# EAGLE design ARK (EAGLE 9.5.2)
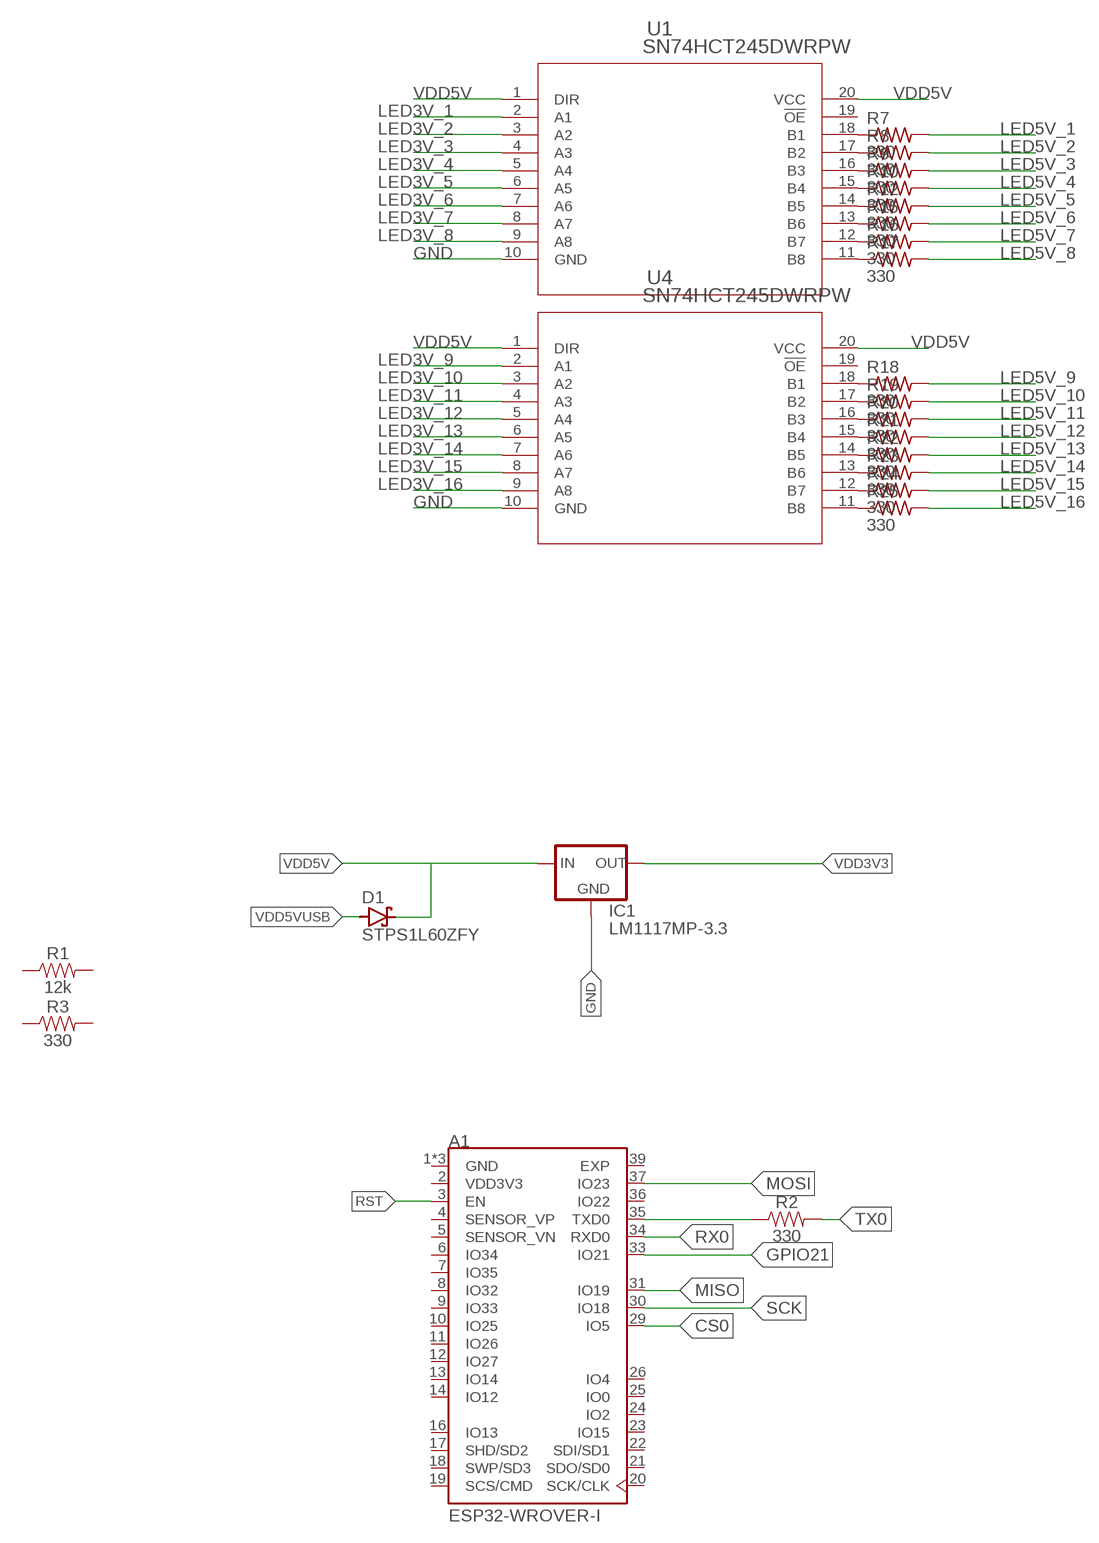
[diagram p0: schematic, sheet 1, part 1 of 2]
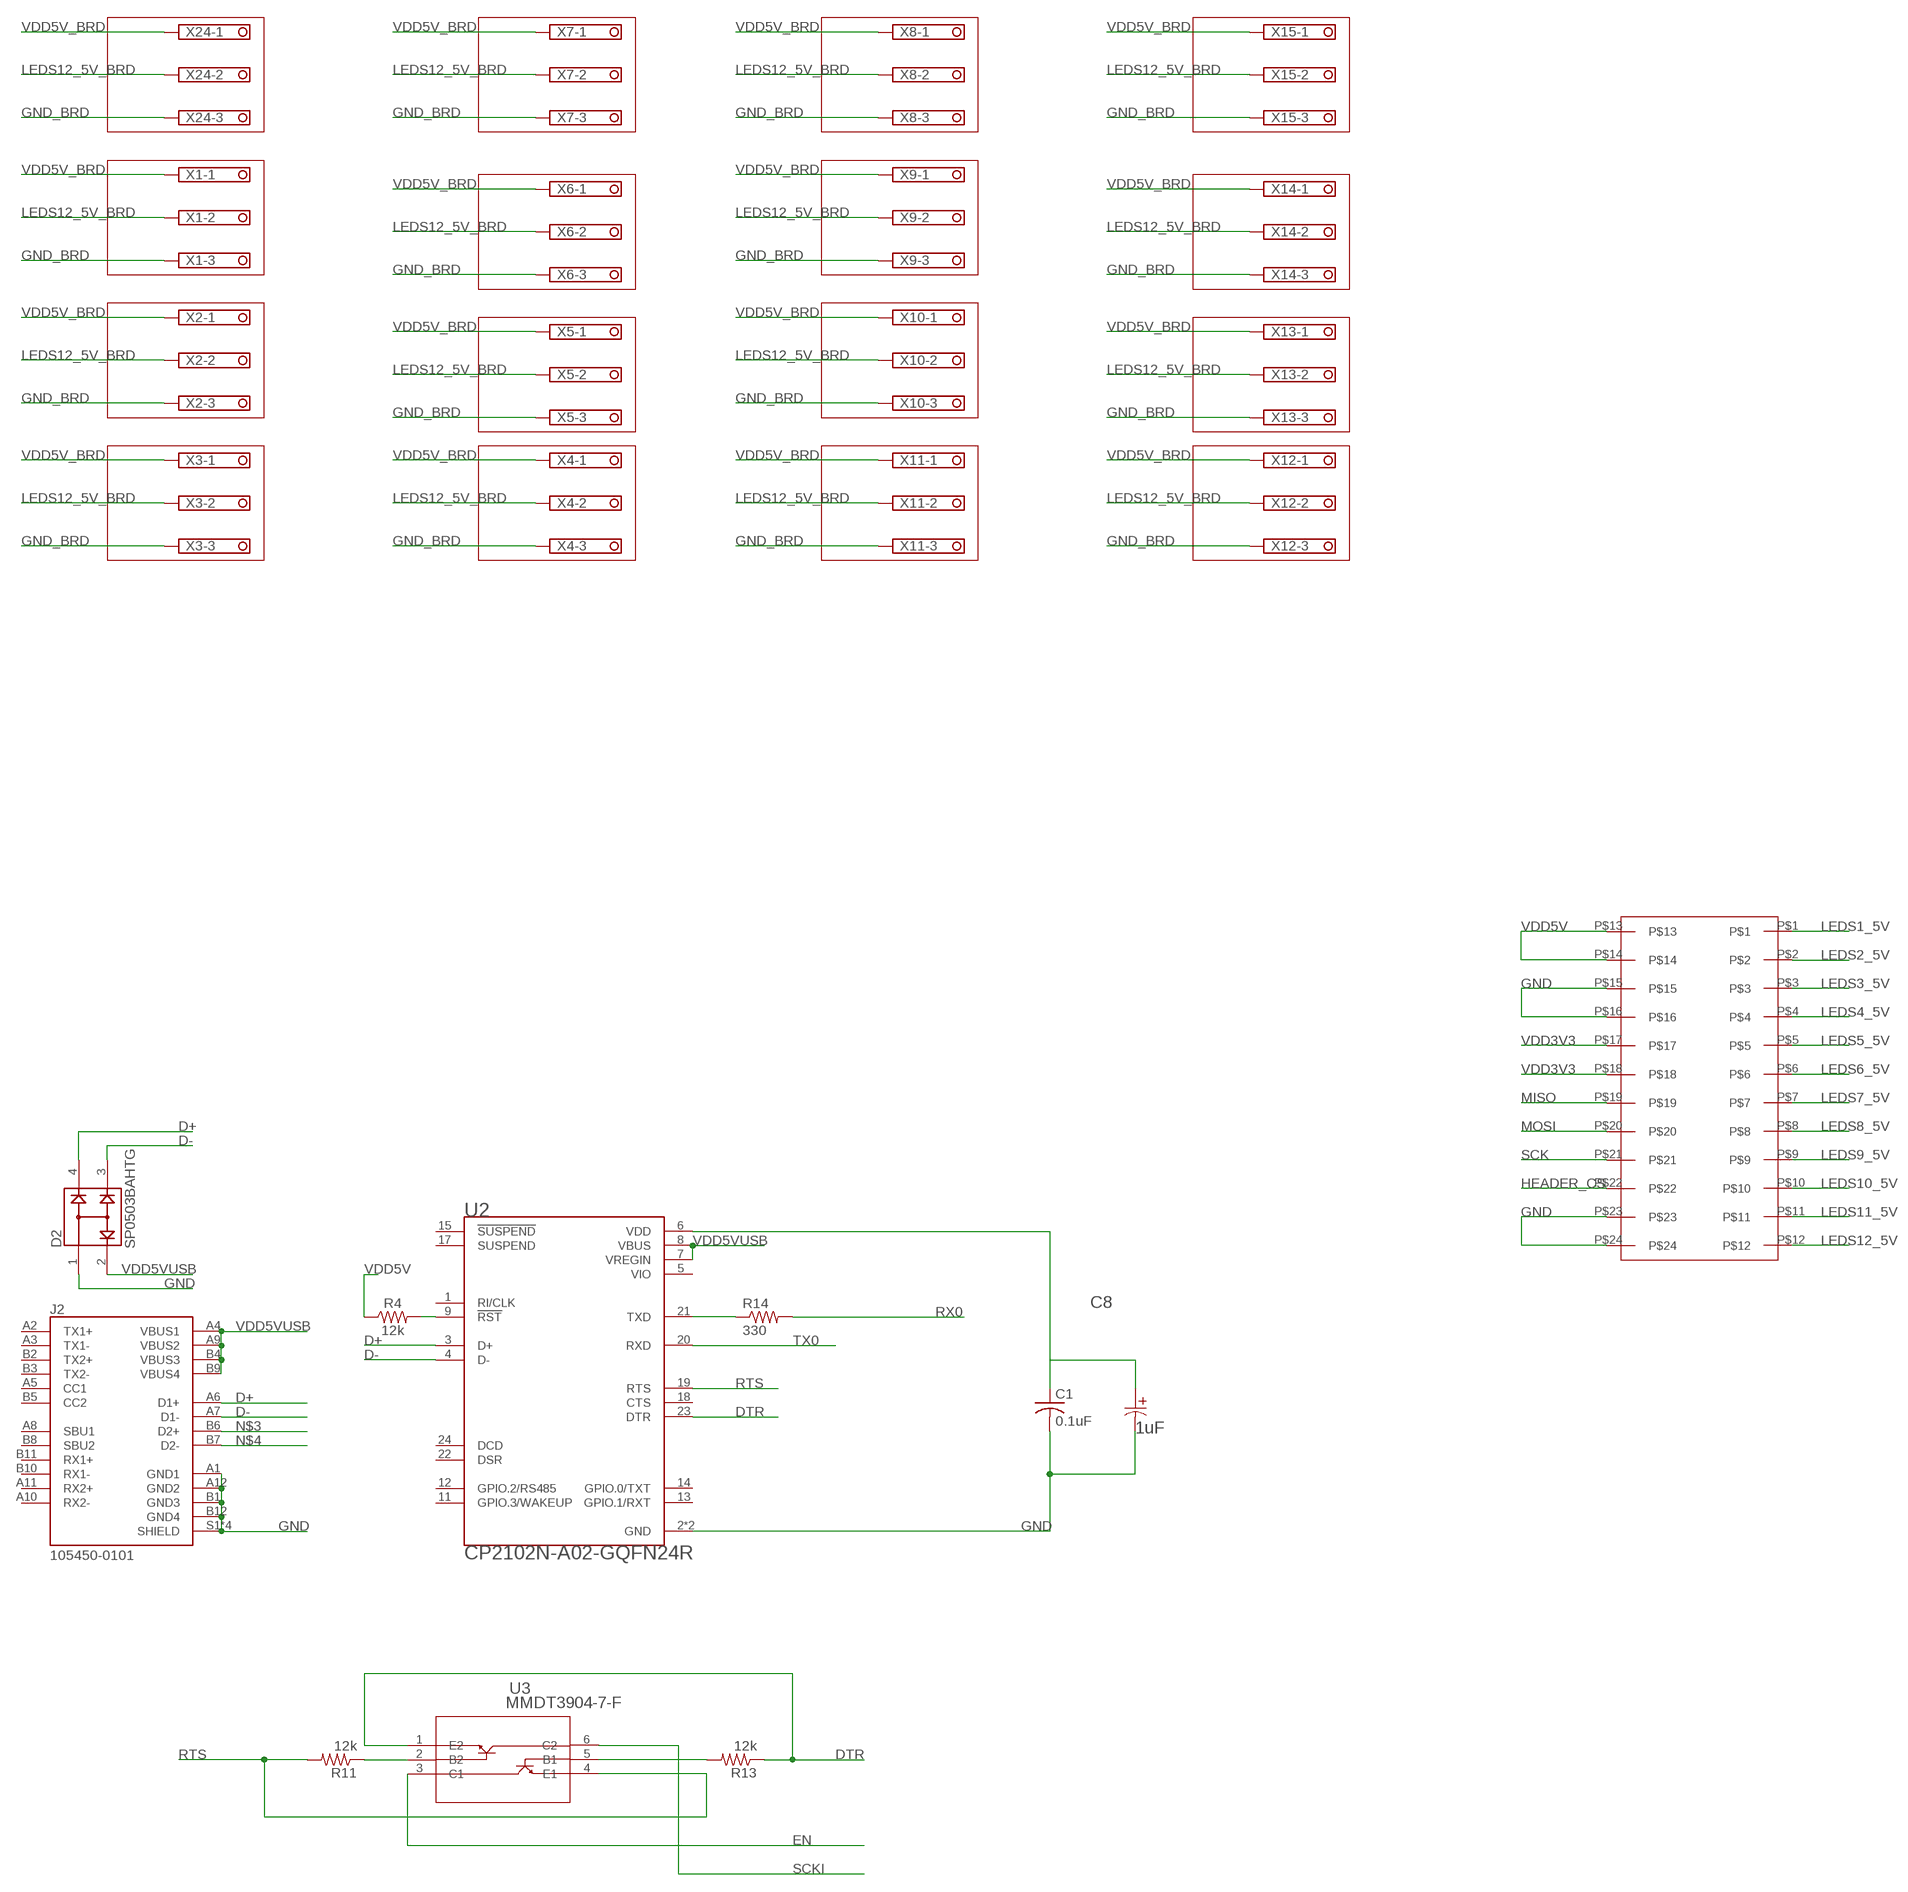
[diagram p1: schematic, sheet 1, part 2 of 2]

## Parts
A1  ESP32-WROVER-I  [XCVR_ESP32-WROVER-I]
C1  0.1uF  C-USC0402  [C0402]
C8  1uF  EEEFC1V1R0R  [CAP_EEFC_B]
D1  STPS1L60ZFY  MBR0520LT1G  [SOD-123]
D2  SP0503BAHTG  [SOT143]
IC1  LM1117MP-3.3  [SOT223]
J2  105450-0101  [MOLEX_105450-0101]
R1  12k  12KOHM-0603-1/10W-1%  [0603]
R2  330  12KOHM-0603-1/10W-1%  [0603]
R3  330  12KOHM-0603-1/10W-1%  [0603]
R4  12k  12KOHM-0603-1/10W-1%  [0603]
R7  330  RC0603JR-070RL  [RES_0603]
R8  330  RC0603JR-070RL  [RES_0603]
R9  330  RC0603JR-070RL  [RES_0603]
R10  330  RC0603JR-070RL  [RES_0603]
R11  12k  RC0603JR-070RL  [RES_0603]
R12  330  RC0603JR-070RL  [RES_0603]
R13  12k  RC0603JR-070RL  [RES_0603]
R14  330  RC0603JR-070RL  [RES_0603]
R15  330  RC0603JR-070RL  [RES_0603]
R16  330  RC0603JR-070RL  [RES_0603]
R17  330  RC0603JR-070RL  [RES_0603]
R18  330  RC0603JR-070RL  [RES_0603]
R19  330  RC0603JR-070RL  [RES_0603]
R20  330  RC0603JR-070RL  [RES_0603]
R21  330  RC0603JR-070RL  [RES_0603]
R22  330  RC0603JR-070RL  [RES_0603]
R23  330  RC0603JR-070RL  [RES_0603]
R24  330  RC0603JR-070RL  [RES_0603]
R25  330  RC0603JR-070RL  [RES_0603]
U1  SN74HCT245DWRPW  [PW]
U2  CP2102N-A02-GQFN24R  [SILABS_CP2102N-A02-GQFN24R]
U3  MMDT3904-7-F  [SOT-363]
U4  SN74HCT245DWRPW  [PW]
U$9  MY_HEADER  [MY_HEADER]
X1  TERMINAL-BLOCK-3.5MM-3-PIN-LONG-PAD  [TERMINAL-BLOCK-3-PIN-3.5MM-LONG-PAD]
X2  TERMINAL-BLOCK-3.5MM-3-PIN-LONG-PAD  [TERMINAL-BLOCK-3-PIN-3.5MM-LONG-PAD]
X3  TERMINAL-BLOCK-3.5MM-3-PIN-LONG-PAD  [TERMINAL-BLOCK-3-PIN-3.5MM-LONG-PAD]
X4  TERMINAL-BLOCK-3.5MM-3-PIN-LONG-PAD  [TERMINAL-BLOCK-3-PIN-3.5MM-LONG-PAD]
X5  TERMINAL-BLOCK-3.5MM-3-PIN-LONG-PAD  [TERMINAL-BLOCK-3-PIN-3.5MM-LONG-PAD]
X6  TERMINAL-BLOCK-3.5MM-3-PIN-LONG-PAD  [TERMINAL-BLOCK-3-PIN-3.5MM-LONG-PAD]
X7  TERMINAL-BLOCK-3.5MM-3-PIN-LONG-PAD  [TERMINAL-BLOCK-3-PIN-3.5MM-LONG-PAD]
X8  TERMINAL-BLOCK-3.5MM-3-PIN-LONG-PAD  [TERMINAL-BLOCK-3-PIN-3.5MM-LONG-PAD]
X9  TERMINAL-BLOCK-3.5MM-3-PIN-LONG-PAD  [TERMINAL-BLOCK-3-PIN-3.5MM-LONG-PAD]
X10  TERMINAL-BLOCK-3.5MM-3-PIN-LONG-PAD  [TERMINAL-BLOCK-3-PIN-3.5MM-LONG-PAD]
X11  TERMINAL-BLOCK-3.5MM-3-PIN-LONG-PAD  [TERMINAL-BLOCK-3-PIN-3.5MM-LONG-PAD]
X12  TERMINAL-BLOCK-3.5MM-3-PIN-LONG-PAD  [TERMINAL-BLOCK-3-PIN-3.5MM-LONG-PAD]
X13  TERMINAL-BLOCK-3.5MM-3-PIN-LONG-PAD  [TERMINAL-BLOCK-3-PIN-3.5MM-LONG-PAD]
X14  TERMINAL-BLOCK-3.5MM-3-PIN-LONG-PAD  [TERMINAL-BLOCK-3-PIN-3.5MM-LONG-PAD]
X15  TERMINAL-BLOCK-3.5MM-3-PIN-LONG-PAD  [TERMINAL-BLOCK-3-PIN-3.5MM-LONG-PAD]
X24  TERMINAL-BLOCK-3.5MM-3-PIN-LONG-PAD  [TERMINAL-BLOCK-3-PIN-3.5MM-LONG-PAD]

## Nets
CS0: A1.29(IO5)
D+ [LED Data]: D2.4 J2.A6(D1+) U2.3(D+)
D- [LED Data]: D2.3 J2.A7(D1-) U2.4(D-)
DTR [LED Data]: R13.1 U2.23(DTR) U3.1(E2)
EN [LED Data]: U3.3(C1)
GND: C1.2 C8.2 D2.1 IC1.1(GND) J2.A1(GND1) J2.A12(GND2) J2.B1(GND3) J2.B12(GND4) J2.S1(SHIELD) J2.S2(SHIELD) J2.S3(SHIELD) J2.S4(SHIELD) U1.10(GND) U2.2(GND) U2.25(GND) U4.10(GND) U$9.P$15 U$9.P$16 U$9.P$23 U$9.P$24
GND_BRD: X1.3 X2.3 X3.3 X4.3 X5.3 X6.3 X7.3 X8.3 X9.3 X10.3 X11.3 X12.3 X13.3 X14.3 X15.3 X24.3
GPIO21: A1.33(IO21)
HEADER_CS [LED Data]: U$9.P$22
LED3V_1: U1.2(A1)
LED3V_2: U1.3(A2)
LED3V_3: U1.4(A3)
LED3V_4: U1.5(A4)
LED3V_5: U1.6(A5)
LED3V_6: U1.7(A6)
LED3V_7: U1.8(A7)
LED3V_8: U1.9(A8)
LED3V_9: U4.2(A1)
LED3V_10: U4.3(A2)
LED3V_11: U4.4(A3)
LED3V_12: U4.5(A4)
LED3V_13: U4.6(A5)
LED3V_14: U4.7(A6)
LED3V_15: U4.8(A7)
LED3V_16: U4.9(A8)
LED5V_1: R7.2
LED5V_2: R8.2
LED5V_3: R9.2
LED5V_4: R10.2
LED5V_5: R12.2
LED5V_6: R15.2
LED5V_7: R16.2
LED5V_8: R17.2
LED5V_9: R18.2
LED5V_10: R19.2
LED5V_11: R20.2
LED5V_12: R21.2
LED5V_13: R22.2
LED5V_14: R23.2
LED5V_15: R24.2
LED5V_16: R25.2
LEDS1_5V [LED Data]: U$9.P$1
LEDS2_5V [LED Data]: U$9.P$2
LEDS3_5V [LED Data]: U$9.P$3
LEDS4_5V [LED Data]: U$9.P$4
LEDS5_5V [LED Data]: U$9.P$5
LEDS6_5V [LED Data]: U$9.P$6
LEDS7_5V [LED Data]: U$9.P$7
LEDS8_5V [LED Data]: U$9.P$8
LEDS9_5V [LED Data]: U$9.P$9
LEDS10_5V [LED Data]: U$9.P$10
LEDS11_5V [LED Data]: U$9.P$11
LEDS12_5V [LED Data]: U$9.P$12
LEDS12_5V_BRD: X1.2 X2.2 X3.2 X4.2 X5.2 X6.2 X7.2 X8.2 X9.2 X10.2 X11.2 X12.2 X13.2 X14.2 X15.2 X24.2
MISO: A1.31(IO19) U$9.P$19
MOSI: A1.37(IO23) U$9.P$20
N$1: A1.35(TXD0) R2.1
N$2 [LED Data]: C1.1 C8.1 U2.6(VDD)
N$3 [LED Data]: J2.B6(D2+)
N$4 [LED Data]: J2.B7(D2-)
N$5: D1.C
N$6: R4.2 U2.9(!RST)
N$7 [LED Data]: R11.1 U3.2(B2)
N$8 [LED Data]: R13.2 U3.5(B1)
N$11: R7.1 U1.18(B1)
N$12: R8.1 U1.17(B2)
N$13: R9.1 U1.16(B3)
N$14: R10.1 U1.15(B4)
N$15: R12.1 U1.14(B5)
N$16: R15.1 U1.13(B6)
N$17: R16.1 U1.12(B7)
N$18 [LED Data]: R14.1 U2.21(TXD)
N$19: R17.1 U1.11(B8)
N$20: R18.1 U4.18(B1)
N$21: R19.1 U4.17(B2)
N$22: R20.1 U4.16(B3)
N$23: R21.1 U4.15(B4)
N$24: R22.1 U4.14(B5)
N$25: R23.1 U4.13(B6)
N$26: R24.1 U4.12(B7)
N$27: R25.1 U4.11(B8)
RST: A1.3(EN)
RTS [LED Data]: R11.2 U2.19(RTS) U3.4(E1)
RX0: A1.34(RXD0) R14.2
SCK: A1.30(IO18) U$9.P$21
SCKI [LED Data]: U3.6(C2)
TX0: R2.2 U2.20(RXD)
VDD3V3: IC1.2(OUT) IC1.4(OUT) U$9.P$17 U$9.P$18
VDD5V: IC1.3(IN) R4.1 U1.1(DIR) U1.20(VCC) U4.1(DIR) U4.20(VCC) U$9.P$13 U$9.P$14
VDD5V_BRD: X1.1 X2.1 X3.1 X4.1 X5.1 X6.1 X7.1 X8.1 X9.1 X10.1 X11.1 X12.1 X13.1 X14.1 X15.1 X24.1
VDD5VUSB: D1.A D2.2 J2.A4(VBUS1) J2.A9(VBUS2) J2.B4(VBUS3) J2.B9(VBUS4) U2.7(VREGIN) U2.8(VBUS)
Unconnected: A1.4(SENSOR_VP) A1.5(SENSOR_VN) A1.6(IO34) A1.7(IO35) A1.8(IO32) A1.9(IO33) A1.10(IO25) A1.11(IO26) A1.12(IO27) A1.13(IO14) A1.14(IO12) A1.16(IO13) A1.17(SHD/SD2) A1.18(SWP/SD3) A1.19(SCS/CMD) A1.20(SCK/CLK) A1.21(SDO/SD0) A1.22(SDI/SD1) A1.23(IO15) A1.24(IO2) A1.25(IO0) A1.26(IO4) A1.36(IO22) J2.A2(TX1+) J2.A3(TX1-) J2.A5(CC1) J2.A8(SBU1) J2.A10(RX2-) J2.A11(RX2+) J2.B2(TX2+) J2.B3(TX2-) J2.B5(CC2) J2.B8(SBU2) J2.B10(RX1-) J2.B11(RX1+) R1.1 R1.2 R3.1 R3.2 U1.19(!OE) U2.1(RI/CLK) U2.5(VIO) U2.11(GPIO.3/WAKEUP) U2.12(GPIO.2/RS485) U2.13(GPIO.1/RXT) U2.14(GPIO.0/TXT) U2.15(!SUSPEND) U2.17(SUSPEND) U2.18(CTS) U2.22(DSR) U2.24(DCD) U4.19(!OE)

## Power pins joined to a net without a drawn wire
EXP: A1.39(EXP)
GND: A1.1(GND) A1.15(GND) A1.38(GND)
VDD3V3: A1.2(VDD3V3)

## Library data of the parts
A1 = ESP32-WROVER-I:ESP32-WROVER-I: Module: combo; GPIO, I2C x2, I2S x2, SDIO, SPI x3, UART x3; U.FL; AVAILABILITY: Unavailable; DESCRIPTION: Module: combo; GPIO, I2C x2, I2S x2, SDIO, SPI x3, UART x3; U.FL; MF: Espressif Systems; MP: ESP32-WROVER-I; PACKAGE: Module Espressif Systems; PRICE: None
C1 = resistor:C-US: CAPACITOR, American symbol
C8 = EEE-FC1V1R0R:EEEFC1V1R0R; MANUFACTURER_PART_NUMBER: EEEFC1V1R0R; VENDOR: Panasonic
D1 = Diodes:MBR0520LT1G: DIODE SCHOTTKY 20V 500MA SOD123 Manufacturer's datasheet <https://www.onsemi.com/pub/Collateral/MBR0520LT1-D.PDF>; CREATED_BY: PCBLayout.com; DIGIKEY_PART_NUMBER: MBR0520LT1GOSTR-ND; MANUFACTURER: ON Semiconductor; MPN: MBR0520LT1G; PACKAGE: SOD-123
D2 = SP0503BAHTG:SP0503BAHTG: TVS DIODE 5.5VWM 8.5VC SOT143; DESCRIPTION: SP050xBA Series 8 V 30 pF Uni-Directional SMT TVS Avalanche Diode Array SOT-143; DIGI-KEY_PART_NUMBER: F2715CT-ND; DIGI-KEY_PURCHASE_URL: https://www.digikey.com/product-detail/en/littelfuse-inc/SP0503BAHTG/F2715CT-ND/1154322?utm_source=snapeda&utm_medium=aggregator&utm_campaign=symbol; MF: Littelfuse Inc.; MP: SP0503BAHTG; PACKAGE: SOT-143 Littelfuse
IC1 = lm1117:LM1117?-*: 800mA Low-Dropout Linear Regulator Source: http://ww1.microchip.com/downloads/en/DeviceDoc/39760d.pdf; MF: Texas Instruments; MPN: LM1117MP-3.3; OC_FARNELL: 9778195; OC_NEWARK: 28X3416
J2 = 105450-0101:105450-0101: USB Shielded I/O Receptacle; Type C; Right Angle; Surface Mount; Gold over Nickel; DESCRIPTION: USB Shielded I/O Receptacle; Type C; Right Angle; Surface Mount; Gold over Nickel; DIGI-KEY_PART_NUMBER: WM12856CT-ND; DIGI-KEY_PURCHASE_URL: https://www.digikey.com/product-detail/en/molex/1054500101/WM12856CT-ND/5843891?utm_source=snapeda&utm_medium=aggregator&utm_campaign=symbol; MF: Molex; MP: 1054500101; PACKAGE: None
R1 R4 = SparkFun-Resistors:12KOHM: 12kΩ resistor A resistor is a passive two-terminal electrical component that implements electrical resistance as a circuit element. Resistors act to reduce current flow, and, at the same time, act to lower voltage levels within circuits. - Wikipedia; PROD_ID: RES-10327
R2 R3 = SparkFun-Resistors:12KOHM: 12kΩ resistor A resistor is a passive two-terminal electrical component that implements electrical resistance as a circuit element. Resistors act to reduce current flow, and, at the same time, act to lower voltage levels within circuits. - Wikipedia; PROD_ID: RES-10327; VALUE: 12k
R7-R25 = Resistor_Capacitor:RC0603JR-070RL: RES SMD 0 OHM JUMPER 1/10W 0603 Manufacturer's datasheet <http://www.yageo.com/documents/recent/PYu-RC_Group_51_RoHS_L_10.pdf>; CREATED_BY: PCBLayout.com; DIGIKEY_PART_NUMBER: 311-0.0GRTR-ND; MANUFACTURER: Yageo; MPN: RC0603JR-070RL; PACKAGE: SMD 0603
U1 U4 = SN74HCT245DWR :SN74HCT245DWR
U2 = CP2102N-A02-GQFN20R:CP2102N-A02-GQFN24R: IC USB TO UART BRIDGE QFN20
U3 = MMDT3904:MMDT3904-7-F; MANUFACTURER_PART_NUMBER: MMDT39047F; VENDOR: Diodes Inc
U$9 = MY_HEADER:MY_HEADER
X1-X15 X24 = Rembrandt Electronics - Terminal Block 3-5mm v1-0:TERMINAL-BLOCK-3.5MM-3-PIN: Terminal Block 3.5mm Pitch: 3,5 mm Number of pins: 3 Created by Rembrandt Electronics www.rembrandtelectronics.com

## Net classes
1 LED Data: width 0.305 mm, drill 0.25 mm

## Board
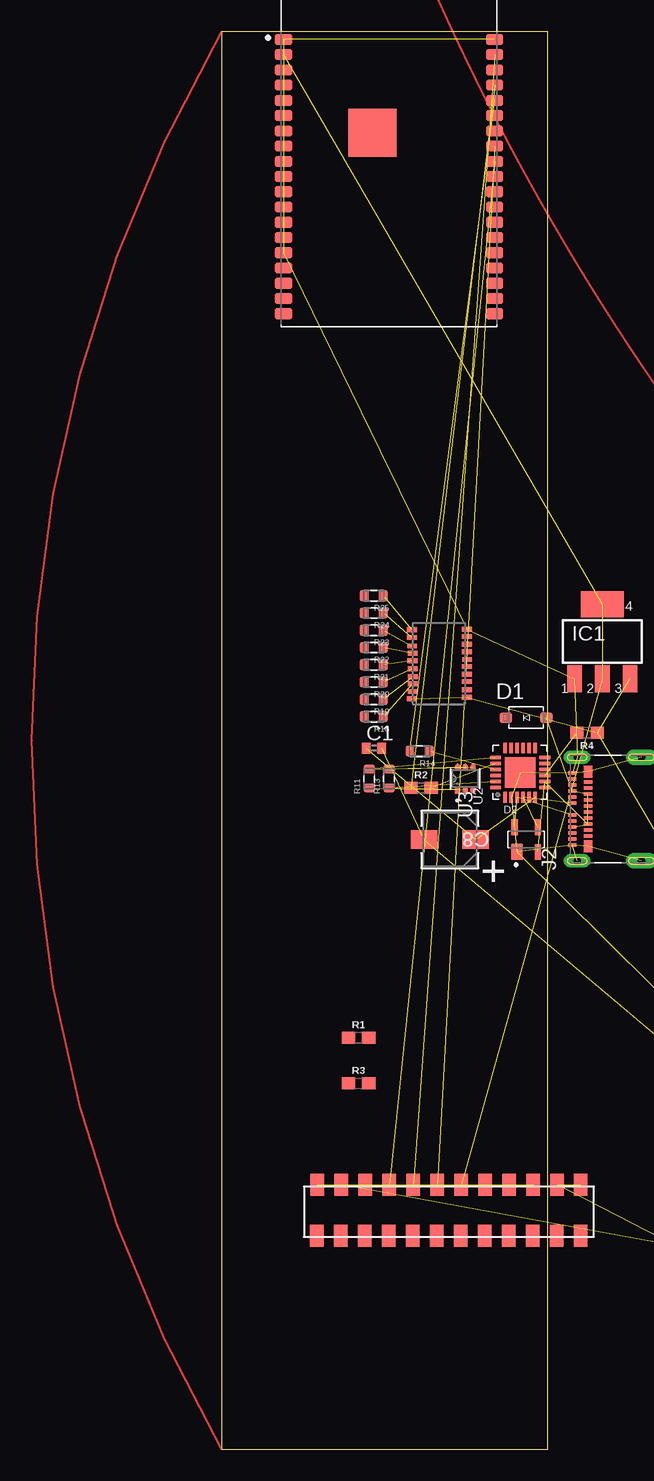
[diagram p2: board, top side]

Size 27.23 x 118.1 mm. Coordinates in mm from the lower left corner, seen from the top.
Outline: 0,0 27.23,0 27.23,118.1 0,118.1 0,0
Copper layers (1*16): Top 0.035mm / dielectric 1.5mm / Bottom 0.035mm
Design rules "default": minimum track width 6mil, minimum drill 0.35mm, track to track 6mil, track to pad 6mil, pad to pad 6mil, via to via 6mil, smd to smd 6mil, copper to edge 40mil, drill to drill 6mil, minimum pad ring 10mil, minimum via ring 8mil, stop-mask expansion 4mil, vias tented up to drill 0mil, thermal gap 10mil

### Footprints (pad centres in the part's own frame; a part is rotated, then mirrored left to right if it is on the bottom)
XCVR_ESP32-WROVER-I = smd 1.45 x 0.93: 1 -8.81,8.26; 2 -8.81,6.99; 3 -8.81,5.72; 4 -8.81,4.45; 5 -8.81,3.18; 6 -8.81,1.91; 7 -8.81,0.64; 8 -8.81,-0.63; 9 -8.81,-1.9; 10 -8.81,-3.17; 11 -8.81,-4.44; 12 -8.81,-5.71; 13 -8.81,-6.98; 14 -8.81,-8.25; 15 -8.81,-9.52; 16 -8.81,-10.79; 17 -8.81,-12.06; 18 -8.81,-13.33; 19 -8.81,-14.6; 20 8.81,-14.6; 21 8.81,-13.33; 22 8.81,-12.06; 23 8.81,-10.79; 24 8.81,-9.52; 25 8.81,-8.25; 26 8.81,-6.98; 27 8.81,-5.71; 28 8.81,-4.44; 29 8.81,-3.17; 30 8.81,-1.9; 31 8.81,-0.63; 32 8.81,0.64; 33 8.81,1.91; 34 8.81,3.18; 35 8.81,4.45; 36 8.81,5.72; 37 8.81,6.99; 38 8.81,8.26 | smd 4 x 4: 39 -1.38,0.47
C0402 = smd 0.7 x 0.9: 1 -0.65,0; 2 0.65,0
CAP_EEFC_B = smd 2.21 x 1.575: 1 -2.159,0; 2 2.159,0
SOD-123 = smd 1.02 x 0.86: A 1.68,0; C -1.68,0
SOT143 = smd 0.99 x 1.3: 1 -0.76,-1.025 | smd 0.59 x 1.3: 2 0.96,-1.025; 3 0.96,1.025; 4 -0.96,1.025
SOT223 = smd 1.219 x 2.235: 1 -2.311,-3.099; 2 0,-3.099; 3 2.311,-3.099 | smd 3.6 x 2.2: 4 0,3.099
MOLEX_105450-0101 = smd 0.3 x 0.7: A1 -3,3.77; A2 -2.5,3.77; A3 -2,3.77; A4 -1.5,3.77; A5 -1,3.77; A6 -0.5,3.77; A7 0.5,3.77; A8 1,3.77; A9 1.5,3.77; A10 2,3.77; A11 2.5,3.77; A12 3,3.77; B2 2.25,2.47; B3 1.75,2.47; B4 1.25,2.47; B5 0.75,2.47; B6 0.25,2.47; B7 -0.25,2.47; B8 -0.75,2.47; B9 -1.25,2.47; B10 -1.75,2.47; B11 -2.25,2.47 | smd 1 x 0.7: B1 3.1,2.47; B12 -3.1,2.47 | drill 0.6 pad 1.1 long: S1 -4.32,3.36; S2 4.32,3.36 | drill 0.6 pad 1.3 long: S3 -4.32,-2; S4 4.32,-2
0603 = smd 1.1 x 1: 1 -0.85,0; 2 0.85,0
RES_0603 = smd 0.74 x 0.93: 1 -0.795,0; 2 0.795,0
PW = smd 0.813 x 0.406: 1 -0.148,-0.418; 2 -0.152,-1.056; 3 -0.152,-1.736; 4 -0.152,-2.34; 5 -0.152,-2.995; 6 -0.156,-3.575; 7 -0.152,-4.233; 8 -0.152,-4.859; 9 -0.152,-5.488; 10 -0.148,-6.098; 11 4.446,-6.065; 12 4.441,-5.404; 13 4.412,-4.699; 14 4.382,-4.082; 15 4.408,-3.466; 16 4.382,-2.796; 17 4.357,-2.151; 18 4.382,-1.548; 19 4.382,-0.908; 20 4.467,-0.317
SILABS_CP2102N-A02-GQFN24R = smd 0.9 x 0.3: 1 -1.55,1.75; 2 -1.55,1.25; 3 -1.55,0.75; 4 -1.55,0.25; 5 -1.55,-0.25; 6 -1.55,-0.75; 13 2.55,-0.75; 14 2.55,-0.25; 15 2.55,0.25; 16 2.55,0.75; 17 2.55,1.25; 18 2.55,1.75 | smd 0.3 x 0.9: 7 -0.75,-1.55; 8 -0.25,-1.55; 9 0.25,-1.55; 10 0.75,-1.55; 11 1.25,-1.55; 12 1.75,-1.55; 19 1.75,2.55; 20 1.25,2.55; 21 0.75,2.55; 22 0.25,2.55; 23 -0.25,2.55; 24 -0.75,2.55 | smd 2.55 x 2.55: 25 0.5,0.5
SOT-363 = smd 0.6 x 0.42: 1 -0.95,0.65; 2 -0.95,0; 3 -0.95,-0.65; 4 0.95,-0.65; 5 0.95,0; 6 0.95,0.65
MY_HEADER = smd 1.12 x 1.83: P$1 -2,0; P$2 0.005,0; P$3 2.005,0; P$4 4.005,0; P$5 6.005,0; P$6 8.005,0; P$7 10.005,0; P$8 12.005,0; P$9 14.005,0; P$10 16.005,0; P$11 18.005,0; P$12 20.005,0; P$13 -2,-4.25; P$14 -0.045,-4.25; P$15 1.955,-4.25; P$16 3.955,-4.25; P$17 5.955,-4.25; P$18 7.955,-4.25; P$19 9.955,-4.25; P$20 11.955,-4.25; P$21 13.955,-4.25; P$22 15.955,-4.25; P$23 17.955,-4.25; P$24 19.955,-4.25
TERMINAL-BLOCK-3-PIN-3.5MM-LONG-PAD = drill 1.1 pad 1.7 long: 1 -3.5,-0.1; 2 0,-0.1; 3 3.5,-0.1

### Placement (x,y rotation side)
A1  13.97,109.22 0 top
C1  12.7,58.42 0 top
C8  19.05,50.8 180 top
D1  25.4,60.96 0 top
D2  25.4,50.8 0 top
IC1  31.75,67.31 0 top
J2  33.02,53.34 90 top
R1  11.43,34.29 0 top
R2  16.64,55.12 0 top
R3  11.43,30.48 0 top
R4  30.48,59.69 180 top
R7  54.61,5.08 180 top  (outside the outline)
R8  54.61,6.52 180 top  (outside the outline)
R9  54.61,7.96 180 top  (outside the outline)
R10  54.61,9.4 180 top  (outside the outline)
R11  12.32,55.88 90 top
R12  54.61,10.84 180 top  (outside the outline)
R13  13.97,55.88 90 top
R14  16.51,58.17 180 top
R15  54.61,12.28 180 top  (outside the outline)
R16  54.61,13.72 180 top  (outside the outline)
R17  54.61,15.16 180 top  (outside the outline)
R18  12.7,61.04 180 top
R19  12.7,62.48 180 top
R20  12.7,63.92 180 top
R21  12.7,65.36 180 top
R22  12.7,66.8 180 top
R23  12.7,68.24 180 top
R24  12.7,69.68 180 top
R25  12.7,71.12 180 top
U1  62.23,6.35 180 top  (outside the outline)
U2  25.4,55.88 90 top
U3  20.32,55.88 90 top
U4  20.32,62.23 180 top
U$9  27.94,17.78 180 top
X1  8.89,-16.51 0 top  (outside the outline)
X2  8.89,-26.67 0 top  (outside the outline)
X3  8.89,-36.83 0 top  (outside the outline)
X4  8.89,-46.99 0 top  (outside the outline)
X5  8.89,-57.15 0 top  (outside the outline)
X6  8.89,-67.31 0 top  (outside the outline)
X7  8.89,-77.47 0 top  (outside the outline)
X8  8.89,-87.63 0 top  (outside the outline)
X9  8.89,-97.79 0 top  (outside the outline)
X10  8.89,-107.95 0 top  (outside the outline)
X11  8.89,-118.11 0 top  (outside the outline)
X12  8.89,-128.27 0 top  (outside the outline)
X13  8.89,-138.43 0 top  (outside the outline)
X14  8.89,-148.59 0 top  (outside the outline)
X15  8.89,-158.75 0 top  (outside the outline)
X24  8.89,-6.35 0 top  (outside the outline)

### Tracks (layer width: path | path; a pad name or v marks a point on that pad's centre or on a via)
D+  (2 unrouted)
D-  (2 unrouted)
DTR  (2 unrouted)
GND  (22 unrouted)
GND_BRD  (15 unrouted)
LEDS12_5V_BRD  (15 unrouted)
MISO  (1 unrouted)
MOSI  (1 unrouted)
N$1  (1 unrouted)
N$2  (2 unrouted)
N$6  (1 unrouted)
N$7  (1 unrouted)
N$8  (1 unrouted)
N$9
  Top 0.152: 0,0 arc-60 0,118.11
N$11  (1 unrouted)
N$12  (1 unrouted)
N$13  (1 unrouted)
N$14  (1 unrouted)
N$15  (1 unrouted)
N$16  (1 unrouted)
N$17  (1 unrouted)
N$18  (1 unrouted)
N$19  (1 unrouted)
N$20  (1 unrouted)
N$21  (1 unrouted)
N$22  (1 unrouted)
N$23  (1 unrouted)
N$24  (1 unrouted)
N$25  (1 unrouted)
N$26  (1 unrouted)
N$27  (1 unrouted)
RTS  (2 unrouted)
RX0  (1 unrouted)
SCK  (1 unrouted)
TX0  (1 unrouted)
VDD3V3  (4 unrouted)
VDD5V  (7 unrouted)
VDD5V_BRD  (15 unrouted)
VDD5VUSB  (7 unrouted)
(copper drawn outside any net)
  shapes: Top circle x2